# Altium schematic sheet Axis Channel.SchDoc
size A
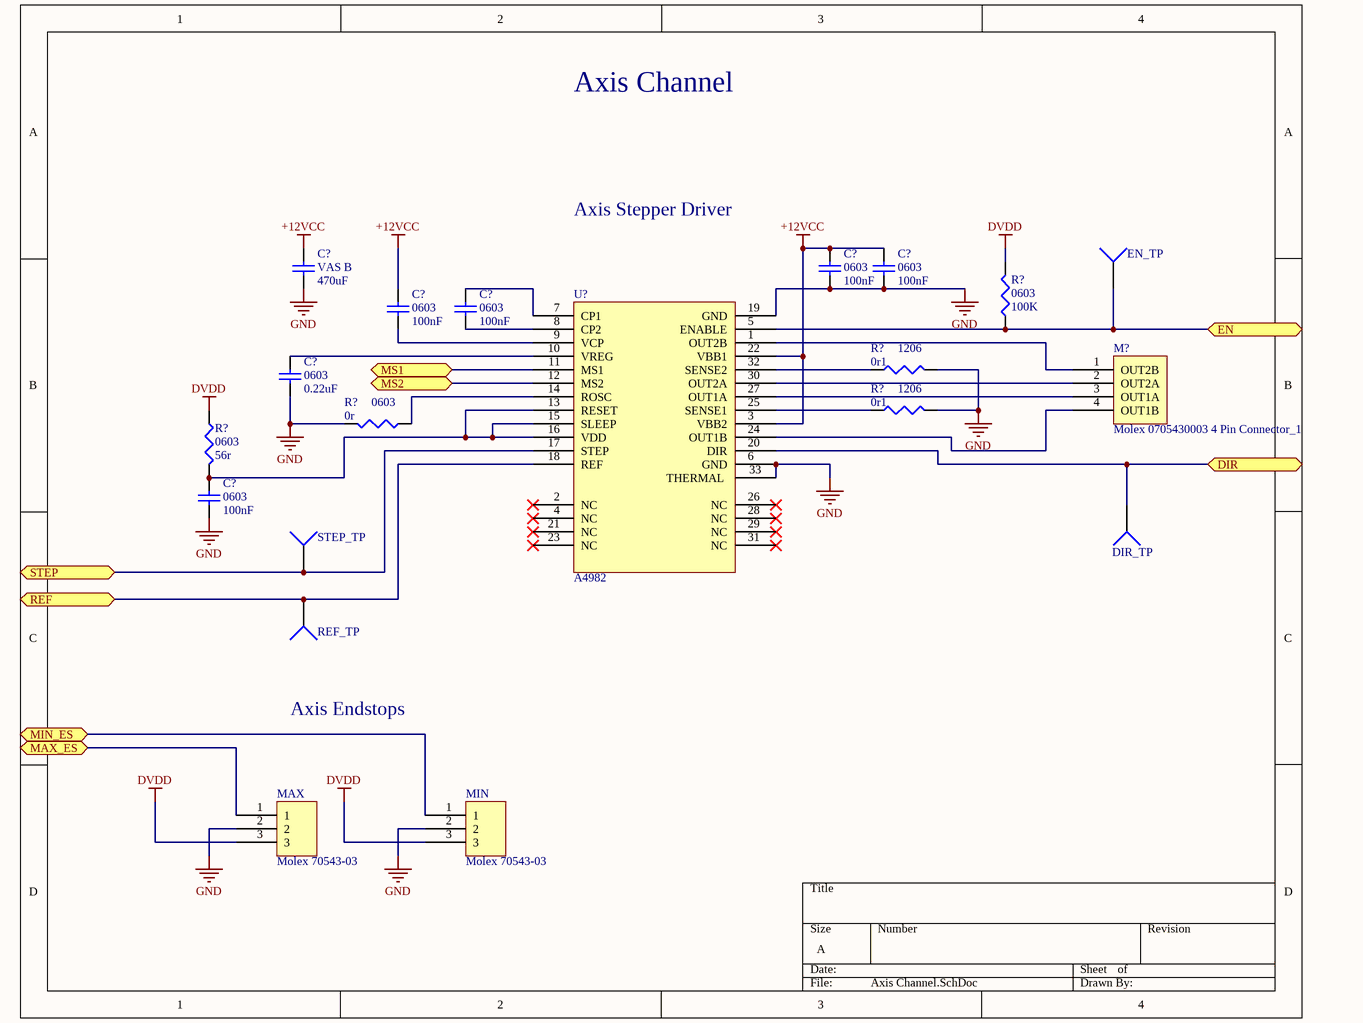
[diagram p0: Axis Channel.SchDoc]

## Parts
(Parts that share a designator on the sheet are numbered #1, #2 ... from top to bottom, then left to right.)
C?#1  VAS B  value 470uF  [Panasonic VS B]
C?#2  0603  value 100nF  [1608[0603]]
C?#3  0603  value 100nF  [1608[0603]]
C?#4  0603  value 100nF  [1608[0603]]
C?#5  0603  value 100nF  [1608[0603]]
C?#6  0603  value 0.22uF  [1608[0603]]
C?#7  0603  value 100nF  [1608[0603]]
DIR_TP  TP4  [PIN1]  (value not drawn)
EN_TP  TP4  [PIN1]  (value not drawn)
M?  Molex 0705430003 4 Pin Connector_1  [Molex 0705430003]
MAX  Molex 70543-03  [MOLEX Endstop]
MIN  Molex 70543-03  [MOLEX Endstop]
R?#1  0603  value 100K  [J1-0603]
R?#2  1206  value 0r1  [1206 SMD Resistor]
R?#3  1206  value 0r1  [1206 SMD Resistor]
R?#4  0603  value 56r  [J1-0603]
R?#5  0603  value 0r  [J1-0603]
REF_TP  TP4  [PIN1]  (value not drawn)
STEP_TP  TP4  [PIN1]  (value not drawn)
U?  A4982  [QFN50P508X508X100_HS-33N]

## Ports
DIR, EN, MAX_ES, MIN_ES, MS1, MS2, REF, STEP

## Nets
+12VCC: C?#1.2 C?#2.2 C?#3.2 C?#4.2 U?.3(VBB2) U?.22(VBB1)
DVDD: MAX.3 MIN.3 R?#1.2 R?#4.1
GND: C?#1.1 C?#2.1 C?#3.1 C?#6.1 C?#7.1 MAX.2 MIN.2 R?#2.2 R?#3.2 R?#5.2 U?.6(GND) U?.19(GND) U?.33(THERMAL)
DIR: DIR_TP.1 U?.20(DIR) ; port DIR
EN: EN_TP.1 R?#1.1 U?.5(ENABLE) ; port EN
MAX_ES: MAX.1 ; port MAX_ES
MIN_ES: MIN.1 ; port MIN_ES
MS1: U?.11(MS1) ; port MS1
MS2: U?.12(MS2) ; port MS2
REF: REF_TP.1 U?.18(REF) ; port REF
STEP: STEP_TP.1 U?.17(STEP) ; port STEP
NetC?#4_1: C?#4.1 U?.9(VCP)
NetC?#5_1: C?#5.1 U?.8(CP2)
NetC?#5_2: C?#5.2 U?.7(CP1)
NetC?#6_2: C?#6.2 U?.10(VREG)
NetC?#7_2: C?#7.2 R?#4.2 U?.13(RESET) U?.15(SLEEP) U?.16(VDD)
NetM?_1: M?.1(OUT2B) U?.1(OUT2B)
NetM?_2: M?.2(OUT2A) U?.30(OUT2A)
NetM?_3: M?.3(OUT1A) U?.27(OUT1A)
NetM?_4: M?.4(OUT1B) U?.24(OUT1B)
NetR?#2_1: R?#2.1 U?.32(SENSE2)
NetR?#3_1: R?#3.1 U?.25(SENSE1)
NetR?#5_1: R?#5.1 U?.14(ROSC)

Not connected (* = marked no-connect by the designer): U? 2(NC)* 4(NC)* 21(NC)* 23(NC)* 26(NC)* 28(NC)* 29(NC)* 31(NC)*

## Notes on the sheet
- Axis Channel
- Axis Stepper Driver
- Axis Endstops

## Library data of the parts
C?#1-C?#7 = Cap Semi: Capacitor (Semiconductor SIM Model); Published: 8-Jun-2000; LatestRevisionDate: 29-May-2009; LatestRevisionNote: IPC-7351 Footprint Added.; PackageReference: C1206; Publisher: Altium Limited; PackageDescription: Chip Capacitor
DIR_TP EN_TP REF_TP STEP_TP = Socket: LatestRevisionDate: 17-Jul-2002; LatestRevisionNote: Re-released for DXP Platform.; Publisher: Altium Limited
MAX MIN = Molex Endstop
R?#1-R?#5 = Res3: Resistor; Published: 8-Jun-2000; LatestRevisionDate: 29-May-2009; LatestRevisionNote: IPC-7351 Footprint Added.; PackageReference: J1-0603; Publisher: Altium Limited; PackageDescription: Chip Resistor
U? = A4982: Alllegor A4982 Stepper Driver